# EAGLE design Greippi_pos_boost (EAGLE 7.4.0)
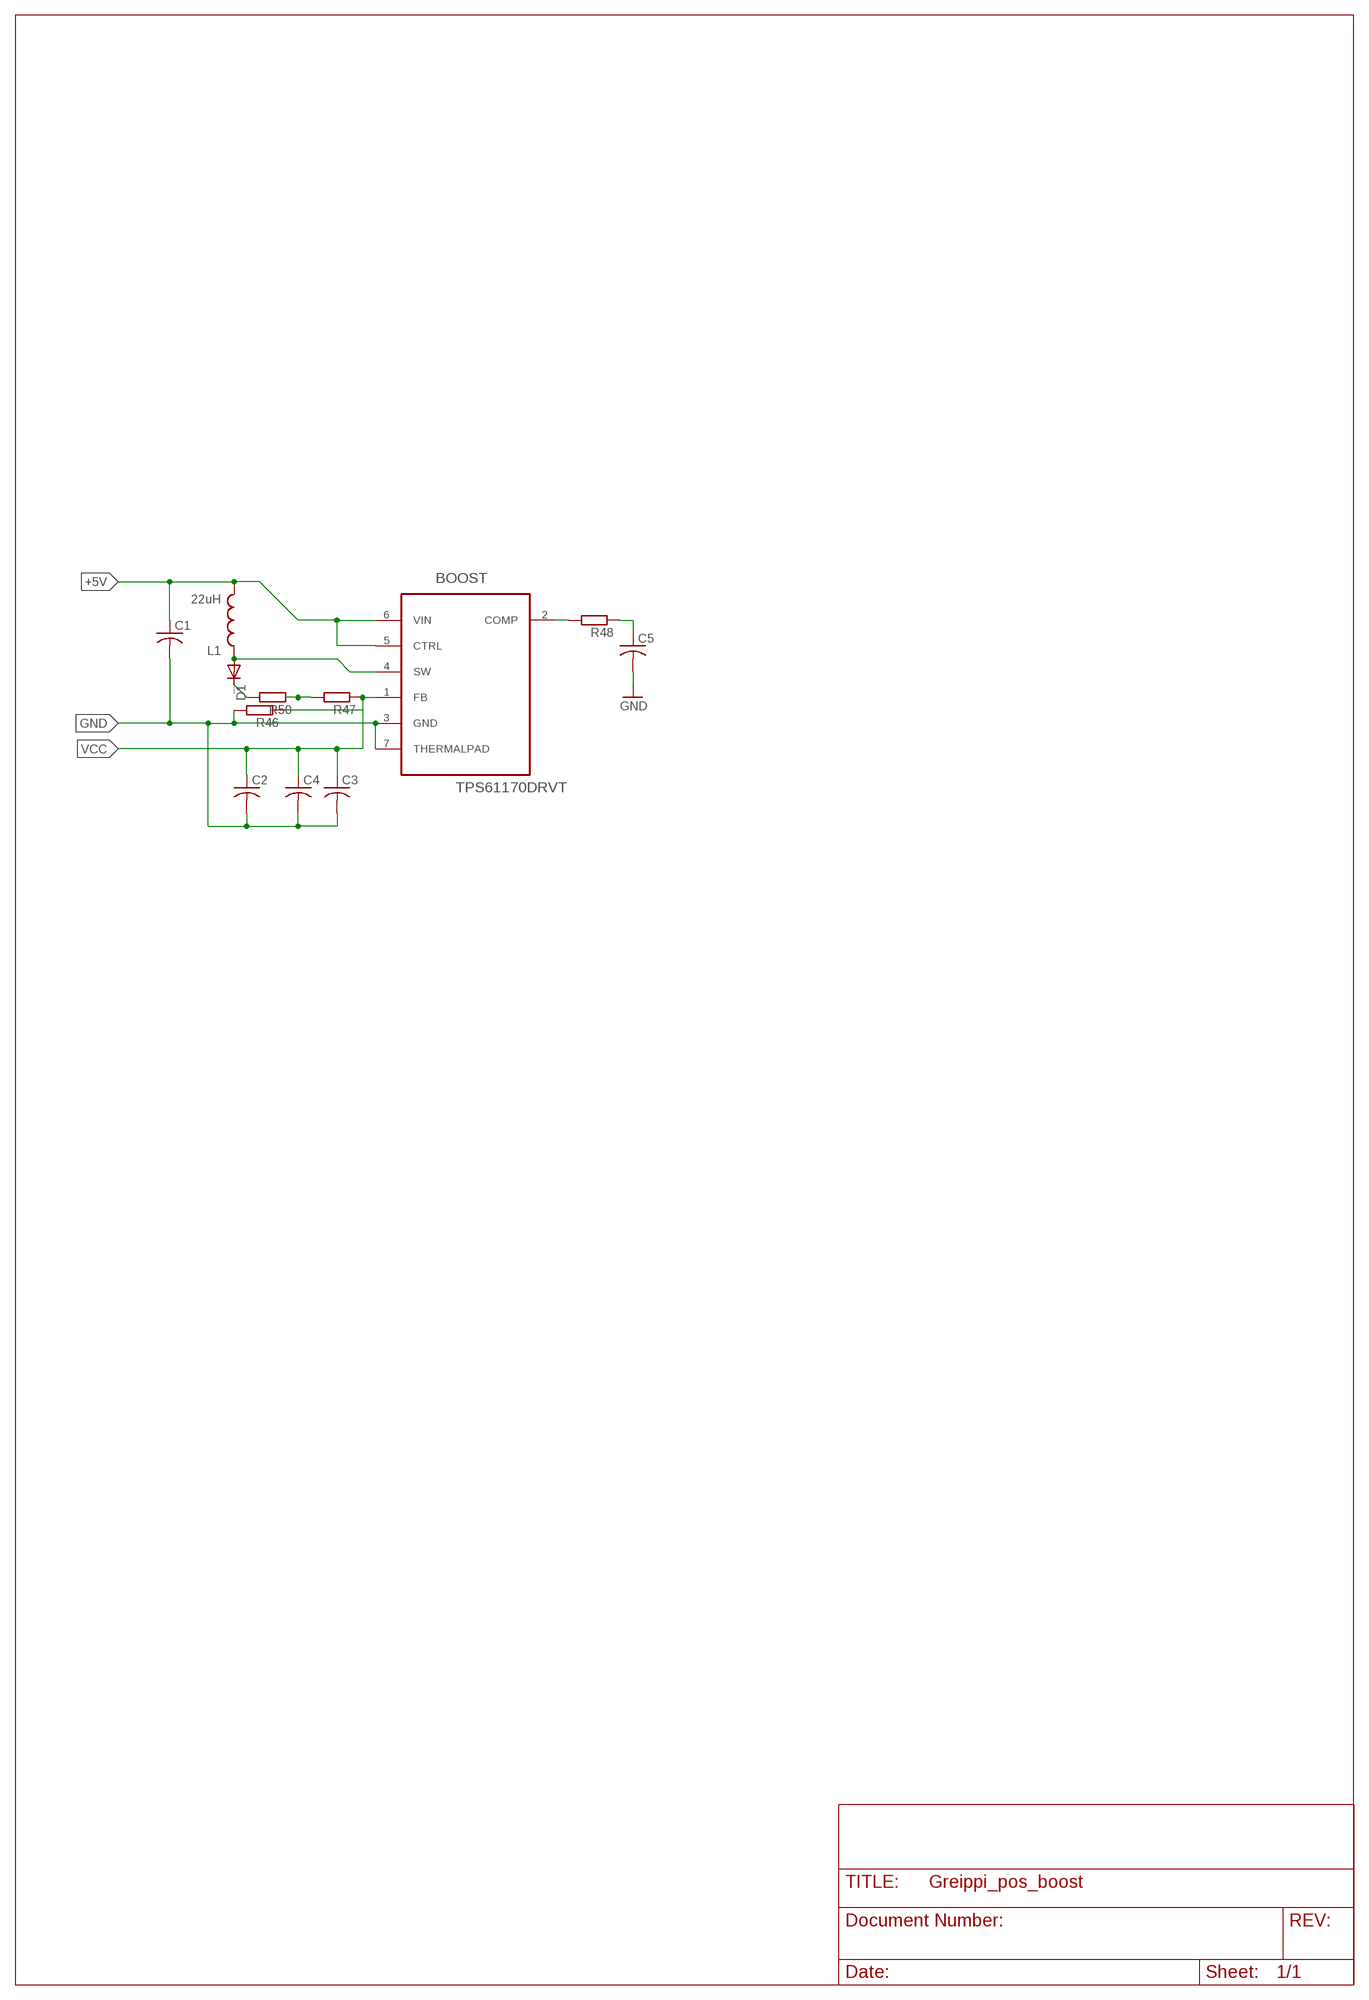
[diagram p0: schematic, sheet 1]

## Parts
BOOST  TPS61170DRVT  [SON65P210X210X80-7N]
C1  C-USC1206  [C1206]
C2  C-USC0805  [C0805]
C3  C-USC1206  [C1206]
C4  C-USC1206  [C1206]
C5  C-USC1206  [C1206]
D1  DIODE-SOD123  [SOD123]
L1  22uH  INDUCTORBOURNS_SRN6045  [SRN6045]
R46  R-EU_R0805  [R0805]
R47  R-EU_R0805  [R0805]
R48  R-EU_R0805  [R0805]
R50  R-EU_R0805  [R0805]

## Nets
+5V: BOOST.5(CTRL) BOOST.6(VIN) C1.1 L1.2
GND: BOOST.3(GND) BOOST.7(THERMALPAD) C1.2 C2.2 C3.2 C4.2 C5.2 R46.2
N$44: BOOST.4(SW) D1.A L1.1
N$47: R47.2 R50.1
N$49: BOOST.2(COMP) R48.2
N$51: C5.1 R48.1
N$75: D1.C R50.2
VCC: BOOST.1(FB) C2.1 C3.1 C4.1 R46.1 R47.1

## Library data of the parts
BOOST = Texas Instruments_By_element14_Batch_1:TPS61170DRVT: 1.2A High Voltage Boost Converter in 2x2mm2 QFN Package; MPN: TPS61170DRVT; OC_FARNELL: 1703404; OC_NEWARK: 65M6342; PACKAGE: SON-6; SUPPLIER: Texas Instruments
C1-C5 = rcl:C-US: CAPACITOR, American symbol
D1 = diode:DIODE-: DIODE
L1 = SparkFun-Passives:INDUCTOR: Inductors Basic Inductor/Choke - 0603 and 1206. Footprints are not proven and vary greatly between part numbers. INDUCTOR POWER 3.3UH 4.0A SMD 0.197" L x 0.197" W x 0.177" H (5.00mm x 5.00mm x 4.50mm); PROD_ID: NDUC-11627; VALUE: 33uH
R46-R48 R50 = rcl:R-EU_: RESISTOR, European symbol

## Board
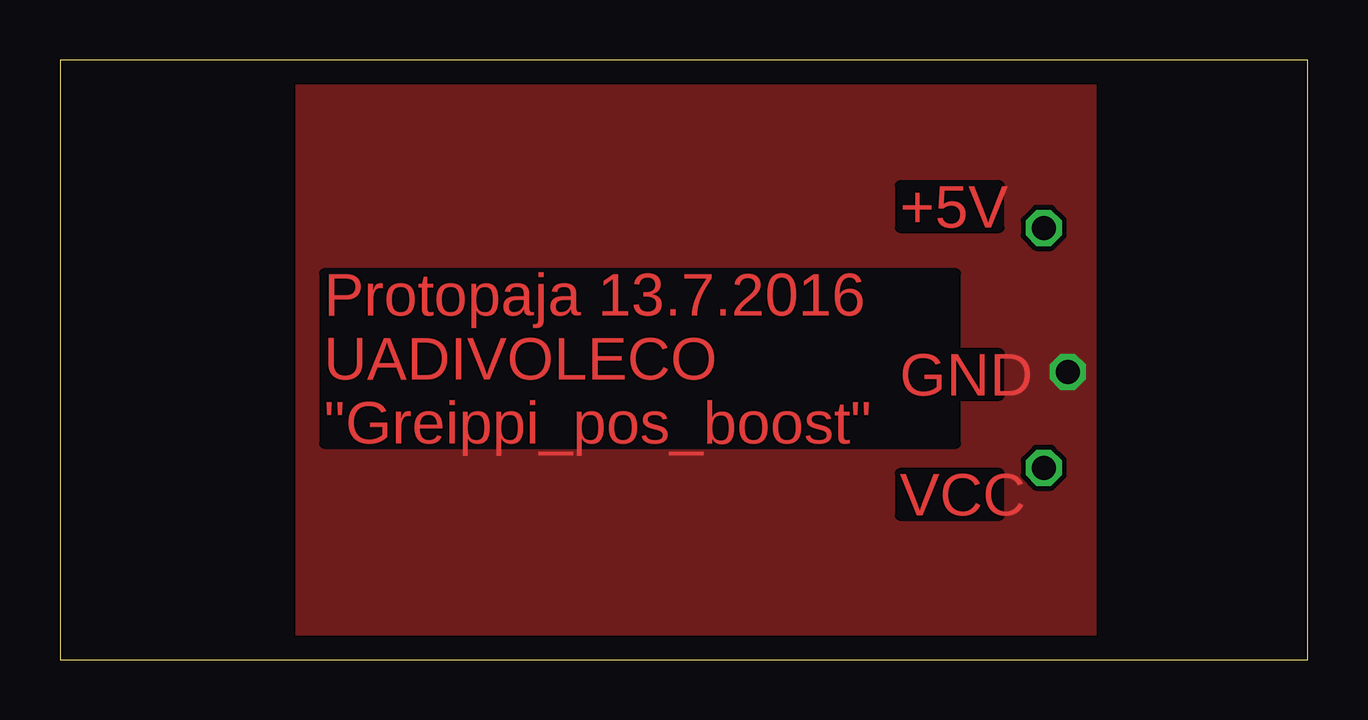
[diagram p1: board, top side]
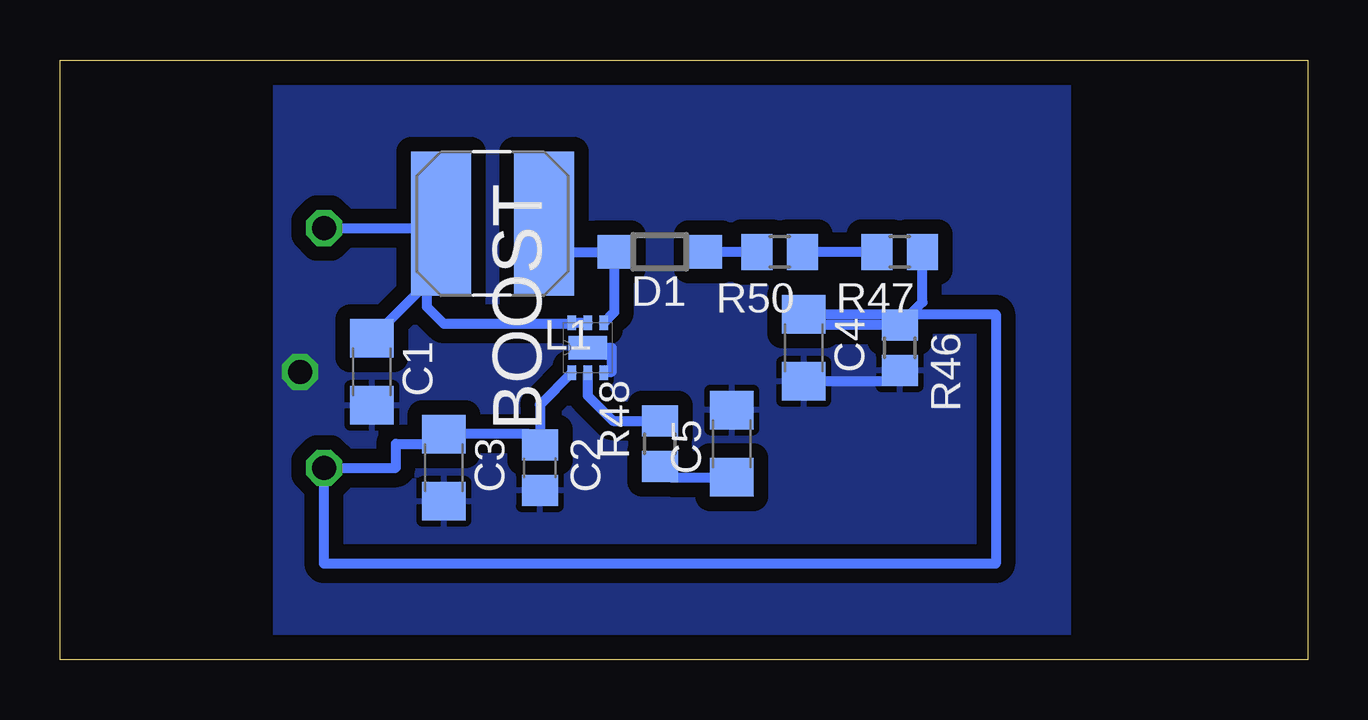
[diagram p2: board, bottom side, seen from below]

Size 52 x 25 mm. Coordinates in mm from the lower left corner, seen from the top.
Outline: 0,0 52,0 52,25 0,25 0,0
Copper layers (1*16): Top 0.035mm / dielectric 1.5mm / Bottom 0.035mm
Design rules "default": minimum track width 10mil, minimum drill 24mil, track to track 8mil, track to pad 8mil, pad to pad 8mil, via to via 8mil, smd to smd 8mil, copper to edge 40mil, drill to drill 8mil, minimum pad ring 10mil, minimum via ring 8mil, stop-mask expansion 4mil, vias tented up to drill 0mil, thermal gap 10mil

### Footprints (pad centres in the part's own frame; a part is rotated, then mirrored left to right if it is on the bottom)
SON65P210X210X80-7N = smd 0.61 x 0.356: 1 -1.041,0.66; 2 -1.041,0; 3 -1.041,-0.66; 4 1.041,-0.66; 5 1.041,0; 6 1.041,0.66 | smd 0.991 x 1.6: 7 0,0
C1206 = smd 1.6 x 1.8: 1 -1.4,0; 2 1.4,0
C0805 = smd 1.3 x 1.5: 1 -0.95,0; 2 0.95,0
SOD123 = smd 1.4 x 1.4: A 1.9,0; C -1.9,0
SRN6045 = smd 2.5 x 6: 1 -2.175,-0.175; 2 2.125,-0.175
R0805 = smd 1.3 x 1.5: 1 -0.95,0; 2 0.95,0

### Placement (x,y rotation side)
BOOST  30,13 90 bottom
C1  39,12 270 bottom
C2  32,8 270 bottom
C3  36,8 270 bottom
C4  21,13 270 bottom
C5  24,9 90 bottom
D1  27,17 180 bottom
L1  34,18 180 bottom
R46  17,13 270 bottom
R47  17,17 180 bottom
R48  27,9 90 bottom
R50  22,17 180 bottom

### Tracks (layer width: path | path; a pad name or v marks a point on that pad's centre or on a via)
+5V  (via drill 1 pad 1.42)
  Bottom 0.406: BOOST.5 BOOST.6 30.7,14 36,14 36.7,14.7 36.7,15.7 | C1.1 36.7,15.7 | 36.7,15.7 36.12,16.28 L1.2 36.12,18 v41,18
GND  (via drill 1 pad 1.42)
  Bottom 0.406: R46.2 17.45,11.6 C4.2 | BOOST.3 29.3,12 29,12 29,13 BOOST.7
  other vias: 42,12
  pour Bottom (isolate 0.61): 10,24 10,1 43,1 43,24
  pour Top: 10,24 10,1 43,1 43,24
N$44
  Bottom 0.406: BOOST.4 28.9,14.48 D1.A 30.65,17 L1.1
N$47
  Bottom 0.406: R47.2 R50.1
N$49
  Bottom 0.406: BOOST.2 30,11 28.95,9.95 R48.2
N$51
  Bottom 0.406: R48.1 26.55,7.6 C5.1
N$75
  Bottom 0.406: R50.2 D1.C
VCC  (via drill 1 pad 1.42)
  Bottom 0.406: R47.1 16.05,14.9 R46.1 21,13.95 C4.1 13,14.4 13,4 41,4 v41,8 38,8 38,9 36,9 C3.1 32.45,9.4 C2.1 32,10.62 BOOST.1

### Text on the board
Top: +5V | GND | Protopaja 13.7.2016 / UADIVOLECO / "Greippi_pos_boost" | VCC